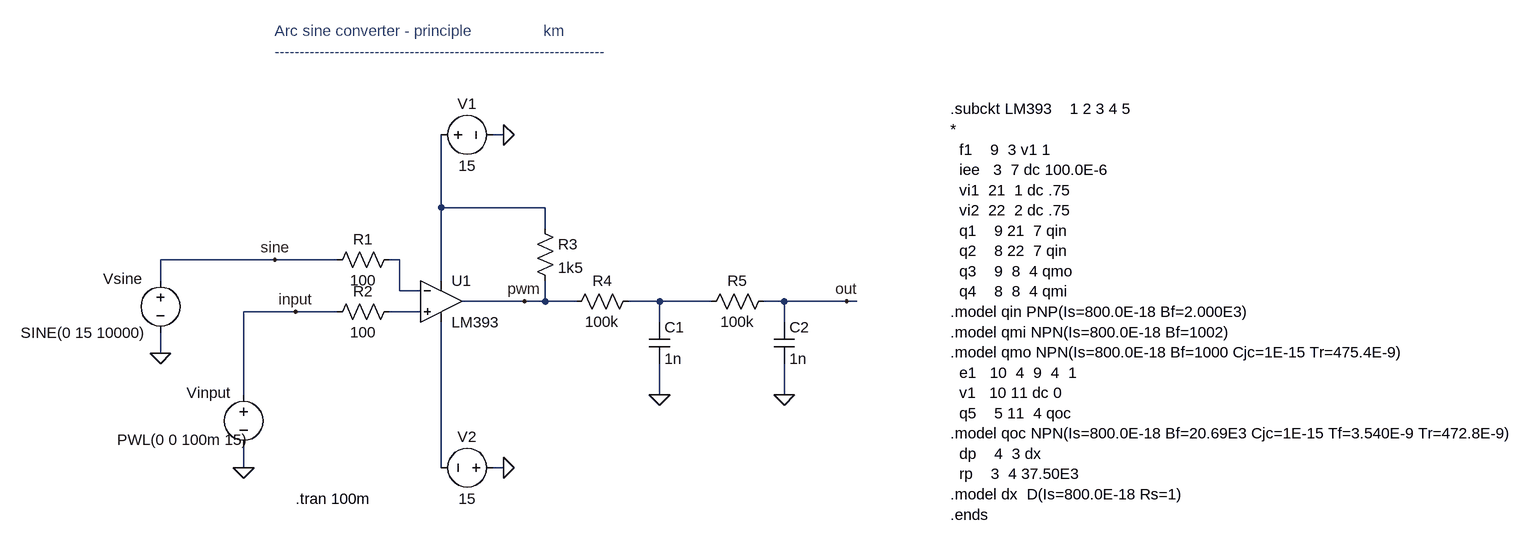
[diagram p0: schematic arc sine.asc]
arc sine.asc, the LTspice schematic file:
Version 4
SHEET 1 1844 680
WIRE 176 -16 160 -16
WIRE 80 96 80 -16
WIRE 240 96 80 96
WIRE 240 128 240 96
WIRE -176 176 -352 176
WIRE -80 176 -176 176
WIRE 16 176 0 176
WIRE -352 208 -352 176
WIRE 80 208 80 96
WIRE 16 224 16 176
WIRE 48 224 16 224
WIRE 208 240 112 240
WIRE 240 240 240 208
WIRE 240 240 208 240
WIRE 288 240 240 240
WIRE 416 240 368 240
WIRE 496 240 416 240
WIRE 608 240 576 240
WIRE 704 240 608 240
WIRE 720 240 704 240
WIRE -144 256 -224 256
WIRE -80 256 -144 256
WIRE 48 256 0 256
WIRE 416 272 416 240
WIRE 608 272 608 240
WIRE -352 320 -352 288
WIRE -224 384 -224 256
WIRE 416 384 416 336
WIRE 608 384 608 336
WIRE -224 496 -224 464
WIRE 80 496 80 272
WIRE 176 496 160 496
FLAG 176 -16 0
FLAG 176 496 0
FLAG -352 320 0
FLAG -224 496 0
FLAG 416 384 0
FLAG 704 240 out
FLAG 208 240 pwm
FLAG -144 256 input
FLAG -176 176 sine
FLAG 608 384 0
SYMBOL Opamps\\opamp2 80 176 R0
SYMATTR InstName U1
SYMATTR Value LM393
SYMBOL voltage 64 -16 R270
WINDOW 0 32 56 VTop 0
WINDOW 3 -32 56 VBottom 0
WINDOW 123 0 0 Left 0
WINDOW 39 0 0 Left 0
SYMATTR InstName V1
SYMATTR Value 15
SYMBOL voltage 176 496 M270
WINDOW 0 32 56 VTop 0
WINDOW 3 -32 56 VBottom 0
WINDOW 123 0 0 Left 0
WINDOW 39 0 0 Left 0
SYMATTR InstName V2
SYMATTR Value 15
SYMBOL voltage -352 192 R0
WINDOW 0 -88 13 Left 0
WINDOW 3 -215 96 Left 0
WINDOW 123 0 0 Left 0
WINDOW 39 0 0 Left 0
SYMATTR InstName Vsine
SYMATTR Value SINE(0 15 10000)
SYMBOL voltage -224 368 R0
WINDOW 0 -88 13 Left 0
WINDOW 3 -195 85 Left 0
WINDOW 123 0 0 Left 0
WINDOW 39 0 0 Left 0
SYMATTR InstName Vinput
SYMATTR Value PWL(0 0 100m 15)
SYMBOL res 16 160 R90
WINDOW 0 0 56 VBottom 0
WINDOW 3 32 56 VTop 0
SYMATTR InstName R1
SYMATTR Value 100
SYMBOL res 16 240 R90
WINDOW 0 0 56 VBottom 0
WINDOW 3 32 56 VTop 0
SYMATTR InstName R2
SYMATTR Value 100
SYMBOL res 224 112 R0
SYMATTR InstName R3
SYMATTR Value 1k5
SYMBOL res 384 224 R90
WINDOW 0 0 56 VBottom 0
WINDOW 3 32 56 VTop 0
SYMATTR InstName R4
SYMATTR Value 100k
SYMBOL cap 400 272 R0
SYMATTR InstName C1
SYMATTR Value 1n
SYMBOL cap 592 272 R0
SYMATTR InstName C2
SYMATTR Value 1n
SYMBOL res 592 224 R90
WINDOW 0 0 56 VBottom 0
WINDOW 3 32 56 VTop 0
SYMATTR InstName R5
SYMATTR Value 100k
TEXT -144 544 Left 0 !.tran 100m
TEXT -176 -176 Left 0 ;Arc sine converter - principle                km\n------------------------------------------------------------------
TEXT 864 -56 Left 0 !.subckt LM393    1 2 3 4 5\n*\n  f1    9  3 v1 1\n  iee   3  7 dc 100.0E-6\n  vi1  21  1 dc .75\n  vi2  22  2 dc .75\n  q1    9 21  7 qin\n  q2    8 22  7 qin\n  q3    9  8  4 qmo\n  q4    8  8  4 qmi\n.model qin PNP(Is=800.0E-18 Bf=2.000E3)\n.model qmi NPN(Is=800.0E-18 Bf=1002)\n.model qmo NPN(Is=800.0E-18 Bf=1000 Cjc=1E-15 Tr=475.4E-9)\n  e1   10  4  9  4  1\n  v1   10 11 dc 0\n  q5    5 11  4 qoc\n.model qoc NPN(Is=800.0E-18 Bf=20.69E3 Cjc=1E-15 Tf=3.540E-9 Tr=472.8E-9)\n  dp    4  3 dx\n  rp    3  4 37.50E3\n.model dx  D(Is=800.0E-18 Rs=1)\n.ends

The netlist it stands for:
* arc sine.asc
XU1 N004 N002 N001 N005 pwm LM393  ; pins In+ In- V+ V- OUT
V1 N001 0 15
V2 0 N005 15
Vsine sine 0 SINE(0 15 10000)
Vinput input 0 PWL(0 0 100m 15)
R1 N002 sine 100
R2 N004 input 100
R3 N001 pwm 1k5
R4 N003 pwm 100k
C1 N003 0 1n
C2 out 0 1n
R5 out N003 100k
.tran 100m
* Arc sine converter - principle                km
* ------------------------------------------------------------------
.subckt LM393    1 2 3 4 5
*
  f1    9  3 v1 1
  iee   3  7 dc 100.0E-6
  vi1  21  1 dc .75
  vi2  22  2 dc .75
  q1    9 21  7 qin
  q2    8 22  7 qin
  q3    9  8  4 qmo
  q4    8  8  4 qmi
.model qin PNP(Is=800.0E-18 Bf=2.000E3)
.model qmi NPN(Is=800.0E-18 Bf=1002)
.model qmo NPN(Is=800.0E-18 Bf=1000 Cjc=1E-15 Tr=475.4E-9)
  e1   10  4  9  4  1
  v1   10 11 dc 0
  q5    5 11  4 qoc
.model qoc NPN(Is=800.0E-18 Bf=20.69E3 Cjc=1E-15 Tf=3.540E-9 Tr=472.8E-9)
  dp    4  3 dx
  rp    3  4 37.50E3
.model dx  D(Is=800.0E-18 Rs=1)
.ends
.backanno
.end